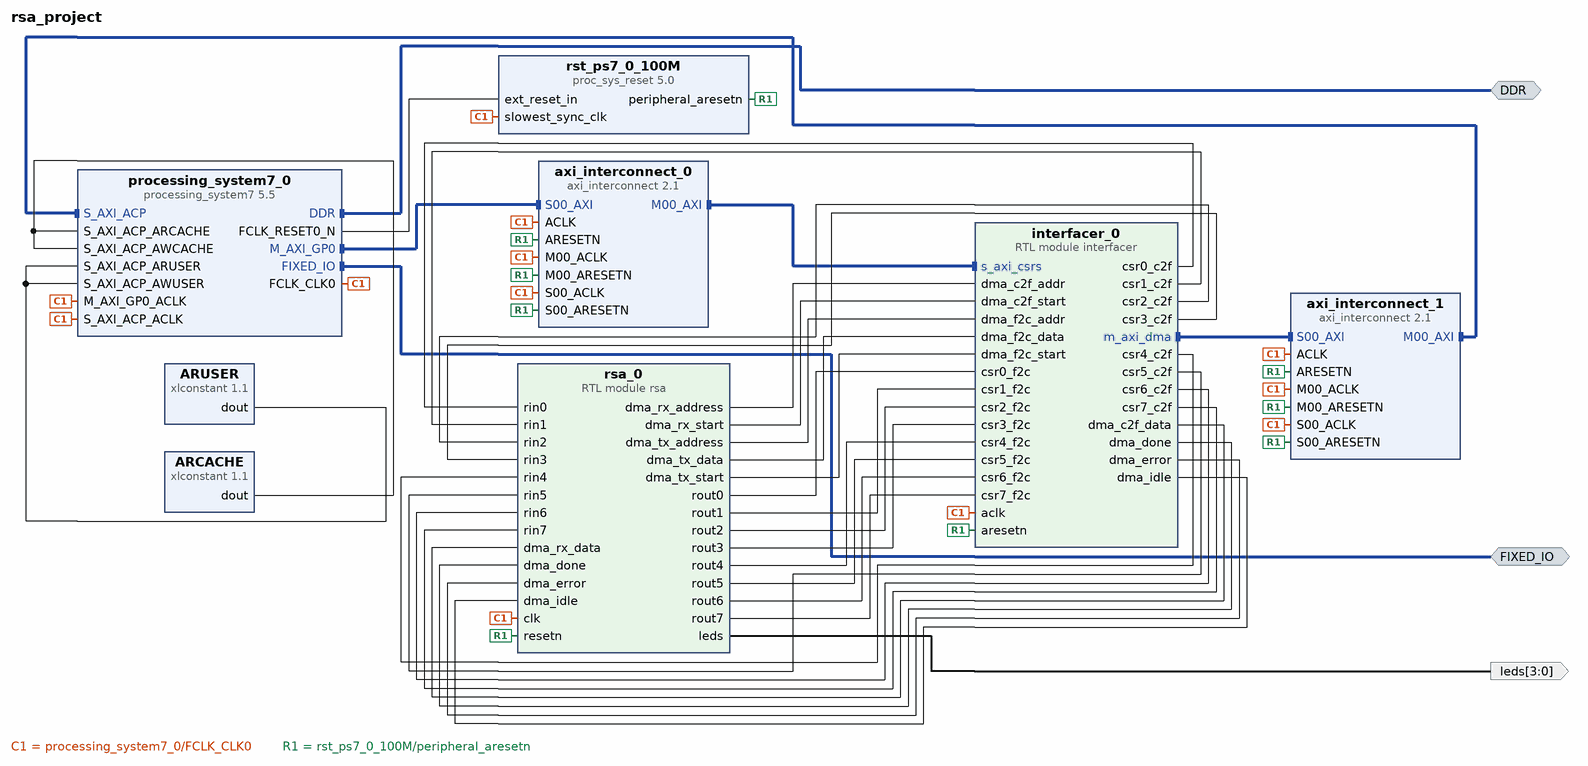
[diagram p0: block diagram of the top level]
# Vivado block design rsa_project, xc7z020clg400-1, Vivado 2023.1
create_bd_design rsa_project

create_bd_intf_port -mode Master -vlnv xilinx.com:interface:ddrx_rtl:1.0 DDR
create_bd_intf_port -mode Master -vlnv xilinx.com:display_processing_system7:fixedio_rtl:1.0 FIXED_IO
create_bd_port -dir O -from 3 -to 0 leds

create_bd_cell -type ip -vlnv xilinx.com:ip:xlconstant:1.1 ARCACHE
set_property -dict {CONFIG.CONST_VAL 2 CONFIG.CONST_WIDTH 4} [get_bd_cells ARCACHE]
create_bd_cell -type ip -vlnv xilinx.com:ip:xlconstant:1.1 ARUSER
set_property -dict {CONFIG.CONST_WIDTH 5} [get_bd_cells ARUSER]
create_bd_cell -type ip -vlnv xilinx.com:ip:axi_interconnect:2.1 axi_interconnect_0
set_property -dict {CONFIG.NUM_MI 1} [get_bd_cells axi_interconnect_0]
create_bd_cell -type ip -vlnv xilinx.com:ip:axi_interconnect:2.1 axi_interconnect_1
set_property -dict [list \
  CONFIG.ENABLE_ADVANCED_OPTIONS 1 \
  CONFIG.NUM_MI 1 \
  CONFIG.SYNCHRONIZATION_STAGES 2 \
  CONFIG.XBAR_DATA_WIDTH 64 \
] [get_bd_cells axi_interconnect_1]
create_bd_cell -type module -reference interfacer interfacer_0
create_bd_cell -type ip -vlnv xilinx.com:ip:processing_system7:5.5 processing_system7_0
set_property -dict [list \
  CONFIG.PCW_APU_PERIPHERAL_FREQMHZ 650 \
  CONFIG.PCW_CRYSTAL_PERIPHERAL_FREQMHZ 50 \
  CONFIG.PCW_ENET0_ENET0_IO {MIO 16 .. 27} \
  CONFIG.PCW_ENET0_GRP_MDIO_ENABLE 1 \
  CONFIG.PCW_ENET0_GRP_MDIO_IO {MIO 52 .. 53} \
  CONFIG.PCW_ENET0_PERIPHERAL_ENABLE 1 \
  CONFIG.PCW_ENET0_RESET_ENABLE 1 \
  CONFIG.PCW_ENET0_RESET_IO {MIO 9} \
  CONFIG.PCW_ENET_RESET_ENABLE 1 \
  CONFIG.PCW_ENET_RESET_SELECT {Share reset pin} \
  CONFIG.PCW_FPGA0_PERIPHERAL_FREQMHZ 100 \
  CONFIG.PCW_FPGA1_PERIPHERAL_FREQMHZ 50 \
  CONFIG.PCW_GPIO_MIO_GPIO_ENABLE 1 \
  CONFIG.PCW_GPIO_MIO_GPIO_IO MIO \
  CONFIG.PCW_I2C_RESET_ENABLE 1 \
  CONFIG.PCW_PERIPHERAL_BOARD_PRESET part0 \
  CONFIG.PCW_PRESET_BANK1_VOLTAGE {LVCMOS 1.8V} \
  CONFIG.PCW_QSPI_GRP_FBCLK_ENABLE 1 \
  CONFIG.PCW_QSPI_GRP_FBCLK_IO {MIO 8} \
  CONFIG.PCW_QSPI_GRP_SINGLE_SS_ENABLE 1 \
  CONFIG.PCW_QSPI_GRP_SINGLE_SS_IO {MIO 1 .. 6} \
  CONFIG.PCW_QSPI_PERIPHERAL_ENABLE 1 \
  CONFIG.PCW_QSPI_QSPI_IO {MIO 1 .. 6} \
  CONFIG.PCW_SD0_GRP_CD_ENABLE 1 \
  CONFIG.PCW_SD0_GRP_CD_IO {MIO 47} \
  CONFIG.PCW_SD0_GRP_WP_ENABLE 0 \
  CONFIG.PCW_SD0_PERIPHERAL_ENABLE 1 \
  CONFIG.PCW_SD0_SD0_IO {MIO 40 .. 45} \
  CONFIG.PCW_SDIO_PERIPHERAL_FREQMHZ 50 \
  CONFIG.PCW_SINGLE_QSPI_DATA_MODE x4 \
  CONFIG.PCW_UART0_PERIPHERAL_ENABLE 1 \
  CONFIG.PCW_UART0_UART0_IO {MIO 14 .. 15} \
  CONFIG.PCW_UART1_PERIPHERAL_ENABLE 0 \
  CONFIG.PCW_UART_PERIPHERAL_FREQMHZ 100 \
  CONFIG.PCW_UIPARAM_DDR_BUS_WIDTH {16 Bit} \
  CONFIG.PCW_UIPARAM_DDR_FREQ_MHZ 525 \
  CONFIG.PCW_UIPARAM_DDR_PARTNO {MT41J256M16 RE-125} \
  CONFIG.PCW_USB0_PERIPHERAL_ENABLE 1 \
  CONFIG.PCW_USB0_RESET_ENABLE 1 \
  CONFIG.PCW_USB0_RESET_IO {MIO 46} \
  CONFIG.PCW_USB0_USB0_IO {MIO 28 .. 39} \
  CONFIG.PCW_USB_RESET_ENABLE 1 \
  CONFIG.PCW_USB_RESET_SELECT {Share reset pin} \
  CONFIG.PCW_USE_S_AXI_ACP 1 \
] [get_bd_cells processing_system7_0]
# 498 more settings of processing_system7_0 are not shown: defaults, MIO pin electricals, DDR timing, and values the tool derives
create_bd_cell -type ip -vlnv xilinx.com:ip:proc_sys_reset:5.0 rst_ps7_0_100M
create_bd_cell -type module -reference rsa rsa_0

# ---- connections ----

connect_bd_intf_net [get_bd_intf_pins axi_interconnect_0/S00_AXI] [get_bd_intf_pins processing_system7_0/M_AXI_GP0]
connect_bd_intf_net [get_bd_intf_pins axi_interconnect_0/M00_AXI] [get_bd_intf_pins interfacer_0/s_axi_csrs]
connect_bd_intf_net [get_bd_intf_pins axi_interconnect_1/M00_AXI] [get_bd_intf_pins processing_system7_0/S_AXI_ACP]
connect_bd_intf_net [get_bd_intf_pins axi_interconnect_1/S00_AXI] [get_bd_intf_pins interfacer_0/m_axi_dma]
connect_bd_intf_net [get_bd_intf_pins processing_system7_0/DDR] [get_bd_intf_ports DDR]
connect_bd_intf_net [get_bd_intf_pins processing_system7_0/FIXED_IO] [get_bd_intf_ports FIXED_IO]
connect_bd_net -net Interface_Cell_dout [get_bd_pins ARUSER/dout] \
  [get_bd_pins processing_system7_0/S_AXI_ACP_ARUSER] [get_bd_pins processing_system7_0/S_AXI_ACP_AWUSER]
connect_bd_net -net Interface_Cell_dout1 [get_bd_pins ARCACHE/dout] \
  [get_bd_pins processing_system7_0/S_AXI_ACP_ARCACHE] [get_bd_pins processing_system7_0/S_AXI_ACP_AWCACHE]
connect_bd_net [get_bd_pins processing_system7_0/FCLK_CLK0] \
  [get_bd_pins axi_interconnect_0/ACLK] [get_bd_pins axi_interconnect_0/S00_ACLK] [get_bd_pins axi_interconnect_0/M00_ACLK] \
  [get_bd_pins axi_interconnect_1/ACLK] [get_bd_pins axi_interconnect_1/S00_ACLK] [get_bd_pins axi_interconnect_1/M00_ACLK] \
  [get_bd_pins interfacer_0/aclk] [get_bd_pins processing_system7_0/M_AXI_GP0_ACLK] \
  [get_bd_pins processing_system7_0/S_AXI_ACP_ACLK] [get_bd_pins rst_ps7_0_100M/slowest_sync_clk] [get_bd_pins rsa_0/clk]
connect_bd_net [get_bd_pins interfacer_0/csr0_c2f] [get_bd_pins rsa_0/rin0]
connect_bd_net [get_bd_pins interfacer_0/csr1_c2f] [get_bd_pins rsa_0/rin1]
connect_bd_net [get_bd_pins interfacer_0/csr2_c2f] [get_bd_pins rsa_0/rin2]
connect_bd_net [get_bd_pins interfacer_0/csr3_c2f] [get_bd_pins rsa_0/rin3]
connect_bd_net [get_bd_pins interfacer_0/csr4_c2f] [get_bd_pins rsa_0/rin4]
connect_bd_net [get_bd_pins interfacer_0/csr5_c2f] [get_bd_pins rsa_0/rin5]
connect_bd_net [get_bd_pins interfacer_0/csr6_c2f] [get_bd_pins rsa_0/rin6]
connect_bd_net [get_bd_pins interfacer_0/csr7_c2f] [get_bd_pins rsa_0/rin7]
connect_bd_net [get_bd_pins interfacer_0/dma_c2f_data] [get_bd_pins rsa_0/dma_rx_data]
connect_bd_net [get_bd_pins interfacer_0/dma_done] [get_bd_pins rsa_0/dma_done]
connect_bd_net [get_bd_pins interfacer_0/dma_error] [get_bd_pins rsa_0/dma_error]
connect_bd_net [get_bd_pins interfacer_0/dma_idle] [get_bd_pins rsa_0/dma_idle]
connect_bd_net [get_bd_pins processing_system7_0/FCLK_RESET0_N] [get_bd_pins rst_ps7_0_100M/ext_reset_in]
connect_bd_net [get_bd_pins rsa_0/dma_rx_address] [get_bd_pins interfacer_0/dma_c2f_addr]
connect_bd_net [get_bd_pins rsa_0/dma_rx_start] [get_bd_pins interfacer_0/dma_c2f_start]
connect_bd_net [get_bd_pins rsa_0/dma_tx_address] [get_bd_pins interfacer_0/dma_f2c_addr]
connect_bd_net [get_bd_pins rsa_0/dma_tx_data] [get_bd_pins interfacer_0/dma_f2c_data]
connect_bd_net [get_bd_pins rsa_0/dma_tx_start] [get_bd_pins interfacer_0/dma_f2c_start]
connect_bd_net [get_bd_pins rsa_0/leds] [get_bd_ports leds]
connect_bd_net [get_bd_pins rsa_0/rout0] [get_bd_pins interfacer_0/csr0_f2c]
connect_bd_net [get_bd_pins rsa_0/rout1] [get_bd_pins interfacer_0/csr1_f2c]
connect_bd_net [get_bd_pins rsa_0/rout2] [get_bd_pins interfacer_0/csr2_f2c]
connect_bd_net [get_bd_pins rsa_0/rout3] [get_bd_pins interfacer_0/csr3_f2c]
connect_bd_net [get_bd_pins rsa_0/rout4] [get_bd_pins interfacer_0/csr4_f2c]
connect_bd_net [get_bd_pins rsa_0/rout5] [get_bd_pins interfacer_0/csr5_f2c]
connect_bd_net [get_bd_pins rsa_0/rout6] [get_bd_pins interfacer_0/csr6_f2c]
connect_bd_net [get_bd_pins rsa_0/rout7] [get_bd_pins interfacer_0/csr7_f2c]
connect_bd_net [get_bd_pins rst_ps7_0_100M/peripheral_aresetn] \
  [get_bd_pins axi_interconnect_0/ARESETN] [get_bd_pins axi_interconnect_0/S00_ARESETN] \
  [get_bd_pins axi_interconnect_0/M00_ARESETN] [get_bd_pins axi_interconnect_1/ARESETN] \
  [get_bd_pins axi_interconnect_1/S00_ARESETN] [get_bd_pins axi_interconnect_1/M00_ARESETN] \
  [get_bd_pins interfacer_0/aresetn] [get_bd_pins rsa_0/resetn]

# ---- address map ----
assign_bd_address -offset 0x00000000 -range 512M -target_address_space [get_bd_addr_spaces interfacer_0/m_axi_dma] [get_bd_addr_segs processing_system7_0/S_AXI_ACP/ACP_DDR_LOWOCM]
assign_bd_address -offset 0x40000000 -range 1G -target_address_space [get_bd_addr_spaces interfacer_0/m_axi_dma] [get_bd_addr_segs processing_system7_0/S_AXI_ACP/ACP_M_AXI_GP0]
assign_bd_address -offset 0xE0000000 -range 4M -target_address_space [get_bd_addr_spaces interfacer_0/m_axi_dma] [get_bd_addr_segs processing_system7_0/S_AXI_ACP/ACP_IOP]
assign_bd_address -offset 0xFC000000 -range 16M -target_address_space [get_bd_addr_spaces interfacer_0/m_axi_dma] [get_bd_addr_segs processing_system7_0/S_AXI_ACP/ACP_QSPI_LINEAR]
assign_bd_address -offset 0x40400000 -range 64K -target_address_space [get_bd_addr_spaces processing_system7_0/Data] [get_bd_addr_segs interfacer_0/s_axi_csrs/reg0]

validate_bd_design
save_bd_design
